# Altium schematic sheet MCU.SchDoc
size A4; SheetNumber: 1; SheetTotal: 7
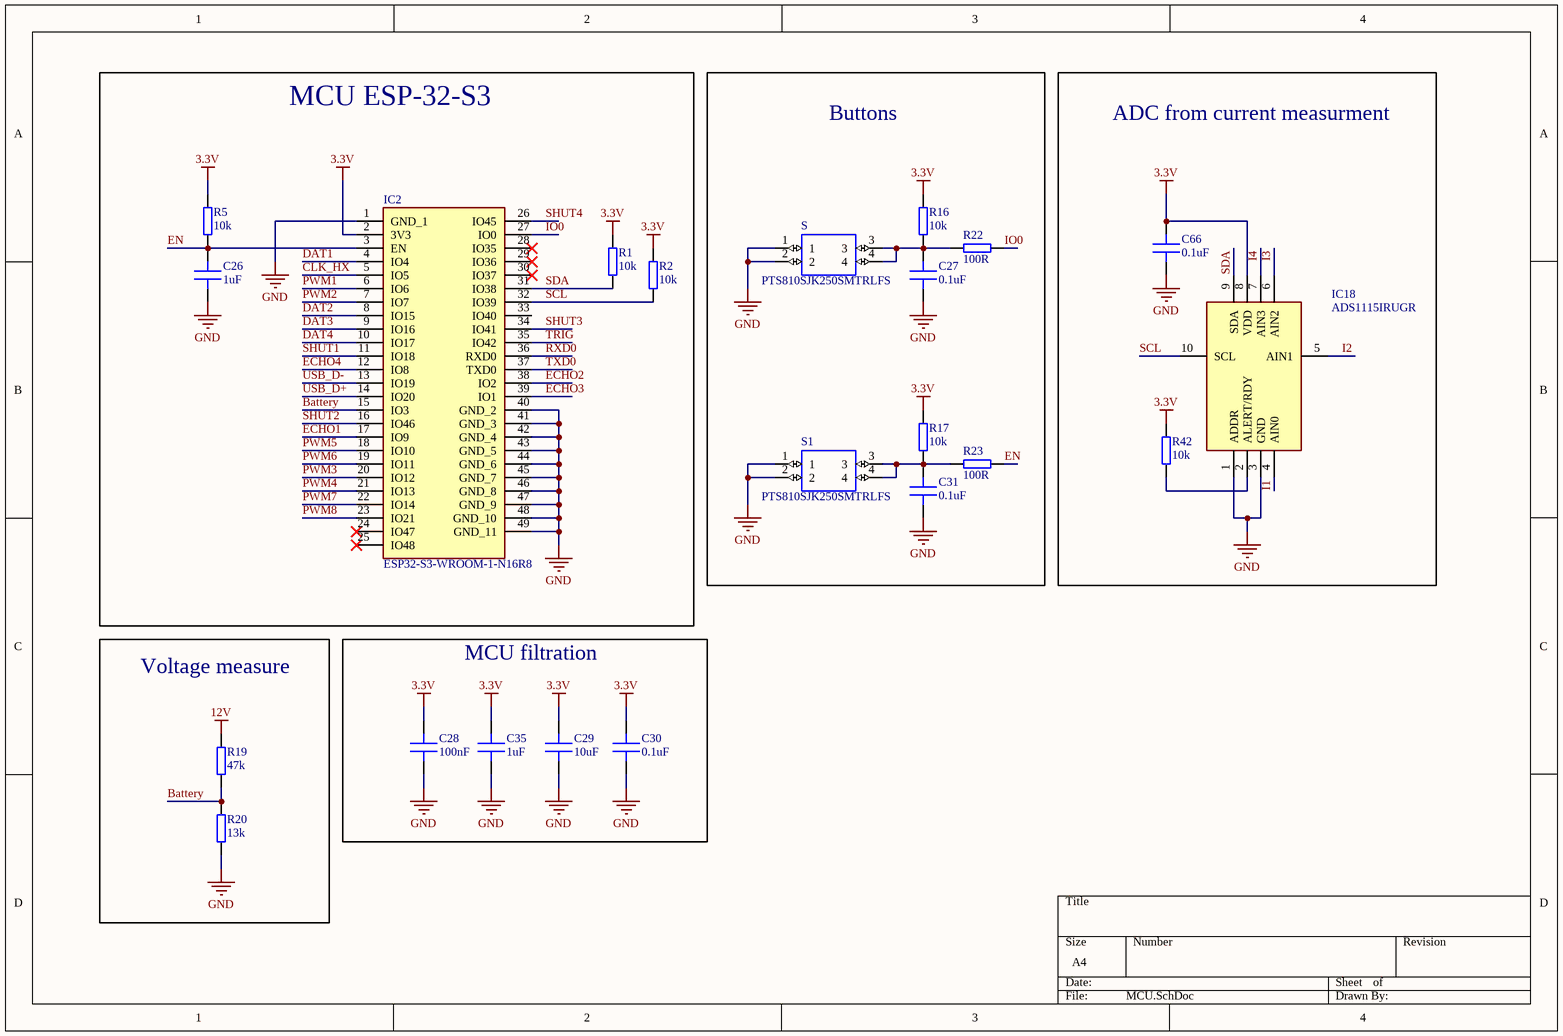
[diagram p0: MCU.SchDoc]

## Parts
C26  1uF  [C 0402]
C27  0.1uF  [C 0402]
C28  100nF  [C 0402]
C29  10uF  [C 0402]
C30  0.1uF  [C 0402]
C31  0.1uF  [C 0402]
C35  1uF  [C 0402]
C66  0.1uF  [C 0402]
IC2  ESP32-S3-WROOM-1-N16R8  [ESP32S3WROOM1N16R8]
IC18  ADS1115IRUGR  [ADS1115IRUGR]
R1  10k  [R 0402]
R2  10k  [R 0402]
R5  10k  [R 0402]
R16  10k  [R 0402]
R17  10k  [R 0402]
R19  47k  [R 0402]
R20  13k  [R 0402]
R22  100R  [R 0402]
R23  100R  [R 0402]
R42  10k  [R 0402]
S  PTS810SJK250SMTRLFS  [PTS810SJG250SMTRLFS]
S1  PTS810SJK250SMTRLFS  [PTS810SJG250SMTRLFS]

## Blocks framed on the sheet
MCU ESP-32-S3: C26 IC2 R1 R2 R5
Buttons: C27 C31 R16 R17 R22 R23 S S1
ADC from current measurment: C66 IC18 R42
Voltage measure: R19 R20
MCU filtration: C28-C30 C35

## Nets
3.3V: C28.1 C29.1 C30.1 C35.1 C66.1 IC2.2(3V3) IC18.8(VDD) R1.2 R2.2 R5.2 R16.2 R17.2 R42.2
12V: R19.2
GND: C26.2 C27.2 C28.2 C29.2 C30.2 C31.2 C35.2 C66.2 IC2.1(GND_1) IC2.40(GND_2) IC2.41(GND_3) IC2.42(GND_4) IC2.43(GND_5) IC2.44(GND_6) IC2.45(GND_7) IC2.46(GND_8) IC2.47(GND_9) IC2.48(GND_10) IC2.49(GND_11) IC18.1(ADDR) IC18.3(GND) R20.1 S.1 S.2 S1.1 S1.2
Battery: IC2.15(IO3) R19.1 R20.2
CLK_HX: IC2.5(IO5)
DAT1: IC2.4(IO4)
DAT2: IC2.8(IO15)
DAT3: IC2.9(IO16)
DAT4: IC2.10(IO17)
ECHO1: IC2.17(IO9)
ECHO2: IC2.38(IO2)
ECHO3: IC2.39(IO1)
ECHO4: IC2.12(IO8)
EN: C26.1 IC2.3(EN) R5.1 R23.1
I1: IC18.4(AIN0)
I2: IC18.5(AIN1)
I3: IC18.6(AIN2)
I4: IC18.7(AIN3)
IO0: IC2.27(IO0) R22.1
PWM1: IC2.6(IO6)
PWM2: IC2.7(IO7)
PWM3: IC2.20(IO12)
PWM4: IC2.21(IO13)
PWM5: IC2.18(IO10)
PWM6: IC2.19(IO11)
PWM7: IC2.22(IO14)
PWM8: IC2.23(IO21)
RXD0: IC2.36(RXD0)
SCL: IC2.32(IO39) IC18.10(SCL) R2.1
SDA: IC2.31(IO38) IC18.9(SDA) R1.1
SHUT1: IC2.11(IO18)
SHUT2: IC2.16(IO46)
SHUT3: IC2.34(IO41)
SHUT4: IC2.26(IO45)
TRIG: IC2.35(IO42)
TXD0: IC2.37(TXD0)
USB_D+: IC2.14(IO20)
USB_D-: IC2.13(IO19)
NetC27_1: C27.1 R16.1 R22.2 S.3 S.4
NetC31_1: C31.1 R17.1 R23.2 S1.3 S1.4
NetIC18_2: IC18.2(ALERT/RDY) R42.1

Not connected (* = marked no-connect by the designer): IC2 24(IO47)* 25(IO48)* 28(IO35)* 29(IO36)* 30(IO37)* 33(IO40)

## Library data of the parts
C26-C31 C35 C66 = Capacitor: MLCC Capacitor
IC2 = ESP32-S3-WROOM-1-N16R8: Integrated Circuit; Manufacturer_Name: Espressif Systems; Datasheet Link: https://www.espressif.com/sites/default/files/documentation/esp32-s3-wroom-1_wroom-1u_datasheet_en.pdf; Height: 3.25mm; Manufacturer_Part_Number: ESP32-S3-WROOM-1-N16R8; Mouser Part Number: 356-ESP32S3WRM1N16R8; Mouser Price/Stock: https://www.mouser.co.uk/ProductDetail/Espressif-Systems/ESP32-S3-WROOM-1-N16R8?qs=Li%252BoUPsLEnvQc9gW6AMhZg%3D%3D
IC18 = ADS1115IRUGR: Integrated Circuit; Manufacturer_Name: Texas Instruments; Datasheet Link: https://www.ti.com/lit/ds/symlink/ads1115.pdf?ts=1601235703022&ref_url=https%253A%252F%252Fwww.ti.com%252Fproduct%252FADS1115%253FkeyMatch%253DADS1115IRUGR%2526tisearch%253DSearch-EN-everything%2526usecase%253DOPN; Height: 0.4mm; Manufacturer_Part_Number: ADS1115IRUGR; Mouser Part Number: 595-ADS1115IRUGR; Mouser Price/Stock: https://www.mouser.co.uk/ProductDetail/Texas-Instruments/ADS1115IRUGR?qs=IK5e5L0zOXhqw%2F8AHSSbuA%3D%3D; Arrow Part Number: ADS1115IRUGR; Arrow Price/Stock: https://www.arrow.com/en/products/ads1115irugr/texas-instruments?region=nac
R1 R2 R5 R16 R17 R19 R20 R22 R23 R42 = Resistor: General pourpouse resistor
S S1 = PTS810SJK250SMTRLFS: Tactile Switch SPST-NO Top Actuated Surface Mount; MF: C&K; SnapEDA_Link: https://www.snapeda.com/parts/PTS810SJK250SMTRLFS/C%26K/view-part/274682/?ref=snap; Package: None; Price: None; MP: PTS810SJK250SMTRLFS; Availability: Unavailable; Value: *